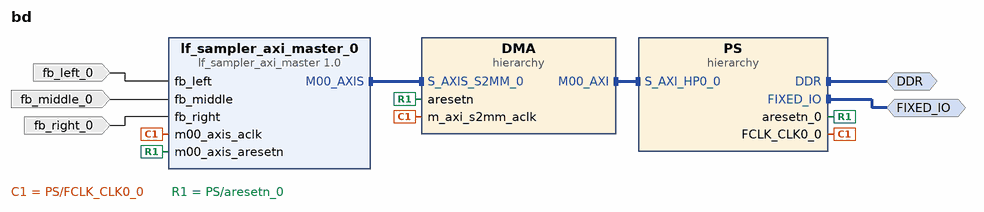
[diagram p0: block diagram of the top level]
# Vivado block design bd, xc7z010clg400-1, Vivado 2023.1
create_bd_design bd

create_bd_intf_port -mode Master -vlnv xilinx.com:interface:ddrx_rtl:1.0 DDR
create_bd_intf_port -mode Master -vlnv xilinx.com:display_processing_system7:fixedio_rtl:1.0 FIXED_IO
create_bd_port -dir I fb_right_0
create_bd_port -dir I fb_middle_0
create_bd_port -dir I fb_left_0

create_bd_cell -type hier PS
create_bd_cell -type hier DMA
create_bd_cell -type ip -vlnv xilinx.com:user:lf_sampler_axi_master:1.0 lf_sampler_axi_master_0

# ---- hierarchy /PS ----
current_bd_instance /PS
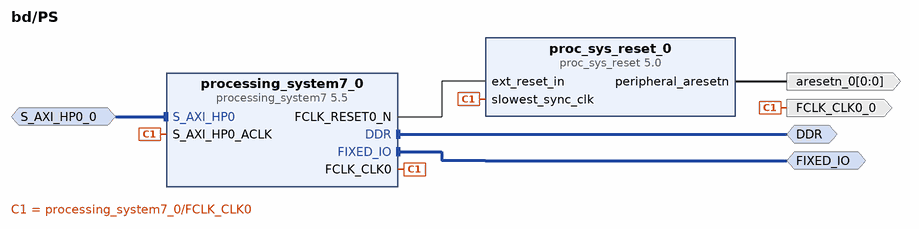
[diagram p1: block diagram inside /PS]
create_bd_intf_pin -mode Master -vlnv xilinx.com:interface:ddrx_rtl:1.0 DDR
create_bd_intf_pin -mode Master -vlnv xilinx.com:display_processing_system7:fixedio_rtl:1.0 FIXED_IO
create_bd_intf_pin -mode Slave -vlnv xilinx.com:interface:aximm_rtl:1.0 S_AXI_HP0_0
create_bd_pin -dir O -type clk FCLK_CLK0_0
create_bd_pin -dir O -from 0 -to 0 -type rst aresetn_0

create_bd_cell -type ip -vlnv xilinx.com:ip:processing_system7:5.5 processing_system7_0
set_property -dict [list \
  CONFIG.PCW_FPGA0_PERIPHERAL_FREQMHZ 125 \
  CONFIG.PCW_USE_M_AXI_GP0 0 \
  CONFIG.PCW_USE_S_AXI_HP0 1 \
] [get_bd_cells processing_system7_0]
# 31 more settings of processing_system7_0 are not shown: defaults, MIO pin electricals, DDR timing, and values the tool derives
create_bd_cell -type ip -vlnv xilinx.com:ip:proc_sys_reset:5.0 proc_sys_reset_0

# ---- hierarchy /DMA ----
current_bd_instance /DMA
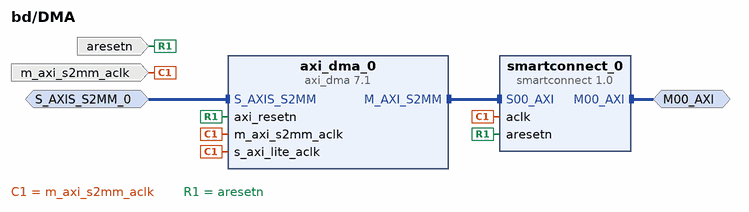
[diagram p2: block diagram inside /DMA]
create_bd_intf_pin -mode Slave -vlnv xilinx.com:interface:axis_rtl:1.0 S_AXIS_S2MM_0
create_bd_intf_pin -mode Master -vlnv xilinx.com:interface:aximm_rtl:1.0 M00_AXI
create_bd_pin -dir I -type clk m_axi_s2mm_aclk
create_bd_pin -dir I -type rst aresetn

create_bd_cell -type ip -vlnv xilinx.com:ip:axi_dma:7.1 axi_dma_0
set_property -dict {CONFIG.c_include_mm2s 0 CONFIG.c_include_sg 0} [get_bd_cells axi_dma_0]
create_bd_cell -type ip -vlnv xilinx.com:ip:smartconnect:1.0 smartconnect_0
set_property -dict {CONFIG.NUM_SI 1} [get_bd_cells smartconnect_0]

# ---- connections ----

current_bd_instance /PS
connect_bd_intf_net [get_bd_intf_pins processing_system7_0/S_AXI_HP0] [get_bd_intf_pins S_AXI_HP0_0]
connect_bd_intf_net [get_bd_intf_pins DDR] [get_bd_intf_pins processing_system7_0/DDR]
connect_bd_intf_net [get_bd_intf_pins FIXED_IO] [get_bd_intf_pins processing_system7_0/FIXED_IO]
connect_bd_net [get_bd_pins proc_sys_reset_0/peripheral_aresetn] [get_bd_pins aresetn_0]
connect_bd_net [get_bd_pins processing_system7_0/FCLK_CLK0] \
  [get_bd_pins FCLK_CLK0_0] [get_bd_pins proc_sys_reset_0/slowest_sync_clk] [get_bd_pins processing_system7_0/S_AXI_HP0_ACLK]
connect_bd_net [get_bd_pins processing_system7_0/FCLK_RESET0_N] [get_bd_pins proc_sys_reset_0/ext_reset_in]

current_bd_instance /DMA
connect_bd_intf_net [get_bd_intf_pins axi_dma_0/S_AXIS_S2MM] [get_bd_intf_pins S_AXIS_S2MM_0]
connect_bd_intf_net [get_bd_intf_pins smartconnect_0/M00_AXI] [get_bd_intf_pins M00_AXI]
connect_bd_intf_net [get_bd_intf_pins axi_dma_0/M_AXI_S2MM] [get_bd_intf_pins smartconnect_0/S00_AXI]
connect_bd_net -net PS_FCLK_CLK0_0 [get_bd_pins m_axi_s2mm_aclk] \
  [get_bd_pins axi_dma_0/m_axi_s2mm_aclk] [get_bd_pins axi_dma_0/s_axi_lite_aclk] [get_bd_pins smartconnect_0/aclk]
connect_bd_net -net PS_aresetn_0 [get_bd_pins aresetn] [get_bd_pins axi_dma_0/axi_resetn] [get_bd_pins smartconnect_0/aresetn]

current_bd_instance /
connect_bd_intf_net -intf_net S_AXI_HP0_0_1 [get_bd_intf_pins PS/S_AXI_HP0_0] [get_bd_intf_pins DMA/M00_AXI]
connect_bd_intf_net [get_bd_intf_pins lf_sampler_axi_master_0/M00_AXIS] [get_bd_intf_pins DMA/S_AXIS_S2MM_0]
connect_bd_intf_net -intf_net processing_system7_0_DDR [get_bd_intf_ports DDR] [get_bd_intf_pins PS/DDR]
connect_bd_intf_net -intf_net processing_system7_0_FIXED_IO [get_bd_intf_ports FIXED_IO] [get_bd_intf_pins PS/FIXED_IO]
connect_bd_net [get_bd_pins PS/FCLK_CLK0_0] [get_bd_pins DMA/m_axi_s2mm_aclk] [get_bd_pins lf_sampler_axi_master_0/m00_axis_aclk]
connect_bd_net [get_bd_pins PS/aresetn_0] [get_bd_pins DMA/aresetn] [get_bd_pins lf_sampler_axi_master_0/m00_axis_aresetn]
connect_bd_net -net fb_left_0_1 [get_bd_ports fb_left_0] [get_bd_pins lf_sampler_axi_master_0/fb_left]
connect_bd_net -net fb_middle_0_1 [get_bd_ports fb_middle_0] [get_bd_pins lf_sampler_axi_master_0/fb_middle]
connect_bd_net -net fb_right_0_1 [get_bd_ports fb_right_0] [get_bd_pins lf_sampler_axi_master_0/fb_right]

# ---- address map ----
assign_bd_address -offset 0x00000000 -range 512M -target_address_space [get_bd_addr_spaces DMA/axi_dma_0/Data_S2MM] [get_bd_addr_segs PS/processing_system7_0/S_AXI_HP0/HP0_DDR_LOWOCM]

validate_bd_design
save_bd_design
